# Altium project bq24259_BatteryCharger.PrjPcb
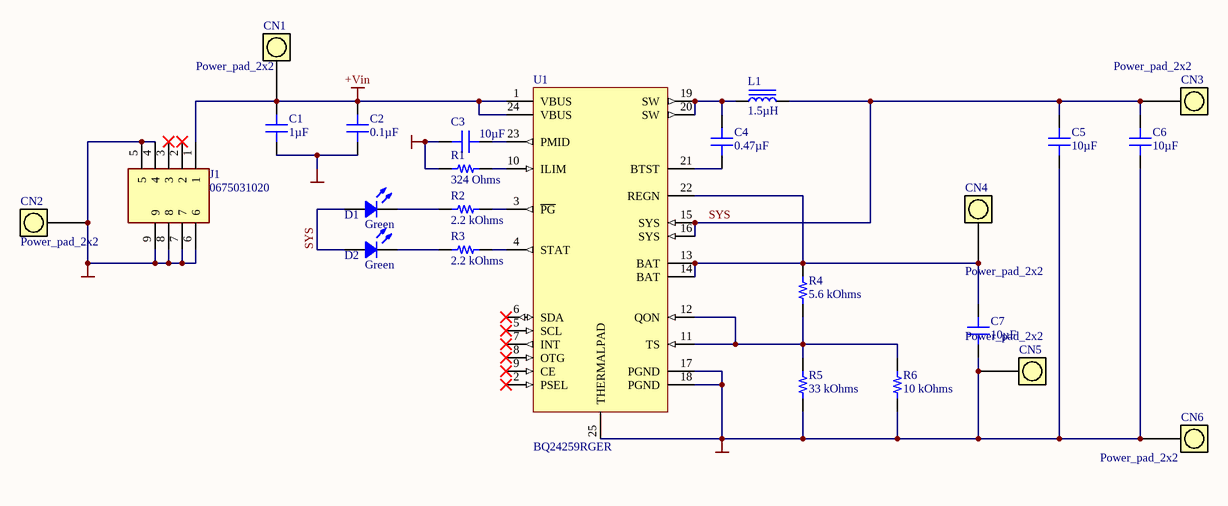
[diagram p0: bq24259_BatteryCharger.SchDoc]
1 sheet, 24 parts. Net scope: global (net labels, ports and power ports of the same name join across sheets).
Board file: bq24259_BatteryCharger.PcbDoc

## Sheet bq24259_BatteryCharger.SchDoc
size A4

### Parts
C1  1µF  [CAP 0805_2012]
C2  0.1µF  [CAP 0805_2012]
C3  10µF  [CAP 0805_2012]
C4  0.47µF  [CAP 0805_2012]
C5  10µF  [CAP 0805_2012]
C6  10µF  [CAP 0805_2012]
C7  10µF  [CAP 0805_2012]
CN1  Power_pad_2x2  [Power_pad_2x2]
CN2  Power_pad_2x2  [Power_pad_2x2]
CN3  Power_pad_2x2  [Power_pad_2x2]
CN4  Power_pad_2x2  [Power_pad_2x2]
CN5  Power_pad_2x2  [Power_pad_2x2]
CN6  Power_pad_2x2  [Power_pad_2x2]
D1  Green  [LED 0603_1608 GREEN]
D2  Green  [LED 0603_1608 GREEN]
J1  0675031020  [0675031020]
L1  1.5µH  [IND 1008_2520]
R1  324 Ohms  [RES 0805_2012]
R2  2.2 kOhms  [RES 0805_2012]
R3  2.2 kOhms  [RES 0805_2012]
R4  5.6 kOhms  [RES 0805_2012]
R5  33 kOhms  [RES 0805_2012]
R6  10 kOhms  [RES 0805_2012]
U1  BQ24259RGER  [QFN50P400X400X100-25N]

### Nets
+Vin: C1.2 C2.2 CN1.1 J1.1 U1.1(VBUS) U1.24(VBUS)
GND: C1.1 C2.1 C3.1 C5.1 C6.1 C7.1 CN2.1 CN5.1 CN6.1 J1.4 J1.5 J1.6 J1.7 J1.8 J1.9 R1.1 R5.1 R6.1 U1.17(PGND) U1.18(PGND) U1.25(THERMALPAD)
SYS: C5.2 C6.2 CN3.1 D1.1 D2.1 L1.2 U1.15(SYS) U1.16(SYS)
NetC3_2: C3.2 U1.23(PMID)
NetC4_1: C4.1 U1.21(BTST)
NetC4_2: C4.2 L1.1 U1.19(SW) U1.20(SW)
NetC7_2: C7.2 CN4.1 R4.1 U1.13(BAT) U1.14(BAT) U1.22(REGN)
NetD1_2: D1.2 R2.1
NetD2_2: D2.2 R3.1
NetR1_2: R1.2 U1.10(ILIM)
NetR2_2: R2.2 U1.3(~{PG})
NetR3_2: R3.2 U1.4(STAT)
NetR4_2: R4.2 R5.2 R6.2 U1.11(TS) U1.12(QON)

Not connected (* = marked no-connect by the designer): J1 2* 3*; U1 2(PSEL)* 5(SCL)* 6(SDA)* 7(INT)* 8(OTG)* 9(CE)*

### Library data of the parts
C1 = MM05ZC105KCZ2A: CAP CER 1UF 10V X7R 0805; Manufacturer: AVX Corporation; Tolerance: ±10%; Part Number: MM05ZC105KCZ2A; Value: 1µF; Applications: Medical, Non-Critical; Capacitance: 1µF; ComponentLink1Description: Datasheet; ComponentLink1URL: http://datasheets.avx.com/AVX-MM.pdf; ComponentLink2Description: DigiKey Link; ComponentLink2URL: http://digikey.com/product-detail/en/avx-corporation/MM05ZC105KCZ2A/478-10611-1-ND/7344872; Device Package: 0805 (2012 Metric); LastUpdated: 2.09.2020 01:04:42; Lifecycle Status: Active; Minimum Order: 1; Mounting Type: Surface Mount, MLCC; Operating Temperature: -55°C ~ 125°C; Package / Case: 0805 (2012 Metric); Packaging: TapeAndReel; PartId: 2439; Part Status: Active; Price: 0.50; Series: MM; Size / Dimension: 0.079" L x 0.049" W (2.01mm x 1.25mm); Supplier 1: DigiKey; Supplier Part Number 1: 478-10611-1-ND; Temperature Coefficient: X7R; Thickness (Max): 0.029" (0.74mm); Voltage - Rated: 10V
C2 = CC0805MRX7R9BB104: CAP CER 0.1UF 50V X7R 0805; Manufacturer: Yageo; Tolerance: ±20%; Part Number: CC0805MRX7R9BB104; Value: 0.1µF; Applications: General Purpose; Capacitance: 0.1µF; ComponentLink1Description: Datasheet; ComponentLink1URL: https://www.yageo.com/upload/media/product/productsearch/datasheet/mlcc/UPY-GPHC_X7R_6.3V-to-50V_18.pdf; ComponentLink2Description: DigiKey Link; ComponentLink2URL: http://digikey.com/product-detail/en/yageo/CC0805MRX7R9BB104/311-4351-1-ND/8025440; Device Package: 0805 (2012 Metric); LastUpdated: 2.09.2020 01:04:42; Lifecycle Status: Active; Minimum Order: 1; Mounting Type: Surface Mount, MLCC; Operating Temperature: -55°C ~ 125°C; Package / Case: 0805 (2012 Metric); Packaging: TapeAndReel; PartId: 2475; Part Status: Active; Price: 0.02; Series: CC; Size / Dimension: 0.079" L x 0.049" W (2.00mm x 1.25mm); Supplier 1: DigiKey; Supplier Part Number 1: 311-4351-1-ND; Temperature Coefficient: X7R; Thickness (Max): 0.037" (0.95mm); Voltage - Rated: 50V
C3 C5-C7 = C0805X106K9RACAUTO: CAP CER 10UF 6.3V X7R 0805; Manufacturer: KEMET; Tolerance: ±10%; Part Number: C0805X106K9RACAUTO; Value: 10µF; Applications: Automotive, Boardflex Sensitive; Capacitance: 10µF; ComponentLink1Description: Datasheet; ComponentLink1URL: https://api.kemet.com/component-edge/download/datasheet/C0805X106K9RACAUTO.pdf; ComponentLink2Description: DigiKey Link; ComponentLink2URL: http://digikey.com/product-detail/en/kemet/C0805X106K9RACAUTO/399-15698-1-ND/7427578; Device Package: 0805 (2012 Metric); Features: Soft Termination; LastUpdated: 2.09.2020 01:04:41; Lifecycle Status: Active; Minimum Order: 1; Mounting Type: Surface Mount, MLCC; Operating Temperature: -55°C ~ 125°C; Package / Case: 0805 (2012 Metric); Packaging: TapeAndReel; PartId: 2960; Part Status: Active; Price: 0.25; Ratings: AEC-Q200; Series: SMD Auto X7R Flex; Size / Dimension: 0.079" L x 0.049" W (2.00mm x 1.25mm); Supplier 1: DigiKey; Supplier Part Number 1: 399-15698-1-ND; Temperature Coefficient: X7R; Thickness (Max): 0.057" (1.45mm); Voltage - Rated: 6.3V
C4 = C0805C474K5RACAUTO: CAP CER 0.47UF 50V X7R 0805; Manufacturer: KEMET; Tolerance: ±10%; Part Number: C0805C474K5RACAUTO; Value: 0.47µF; Applications: Automotive, Bypass, Decoupling; Capacitance: 0.47µF; ComponentLink1Description: Datasheet; ComponentLink1URL: https://api.kemet.com/component-edge/download/datasheet/C0805C474K5RACAUTO.pdf; ComponentLink2Description: DigiKey Link; ComponentLink2URL: http://digikey.com/product-detail/en/kemet/C0805C474K5RACAUTO/399-6976-1-ND/3314485; Device Package: 0805 (2012 Metric); LastUpdated: 2.09.2020 01:04:41; Lifecycle Status: Active; Minimum Order: 1; Mounting Type: Surface Mount, MLCC; Operating Temperature: -55°C ~ 125°C; Package / Case: 0805 (2012 Metric); Packaging: TapeAndReel; PartId: 2727; Part Status: Active; Price: 0.08; Ratings: AEC-Q200; Series: SMD Auto X7R; Size / Dimension: 0.079" L x 0.049" W (2.00mm x 1.25mm); Supplier 1: DigiKey; Supplier Part Number 1: 399-6976-1-ND; Temperature Coefficient: X7R; Thickness (Max): 0.043" (1.10mm); Voltage - Rated: 50V
D1 D2 = LG L29K-G2J1-24-Z: LED GREEN DIFFUSED 0603 SMD; Manufacturer: OSRAM Opto Semiconductors Inc.; Configuration: Standard; Current - Test: 2mA; Lens Color: White; Lens Size: 1.30mm x 0.80mm; Lens Style: Rectangle with Flat Top; Millicandela Rating: 3.92mcd; Viewing Angle: 160°; Voltage - Forward (Vf) (Typ): 1.7V; Wavelength - Dominant: 570nm; Wavelength - Peak: 572nm; Part Number: LG L29K-G2J1-24-Z; Color: Green; ComponentLink1Description: Datasheet; ComponentLink1URL: https://dammedia.osram.info/media/resource/hires/osram-dam-2493945/LG%20L29K.pdf; ComponentLink2Description: DigiKey Link; ComponentLink2URL: http://digikey.com/product-detail/en/osram-opto-semiconductors-inc/LG-L29K-G2J1-24-Z/475-2709-1-ND/1938876; Device Package: 0603 (1608 Metric); Height (Max): 0.65mm; LastUpdated: 2.09.2020 01:20:41; Lens Transparency: Diffused; Lifecycle Status: Active; Minimum Order: 1; Mounting Type: Surface Mount; Package / Case: 0603 (1608 Metric); Packaging: TapeAndReel; PartId: 690; Part Status: Active; Price: 0.10; Series: SMARTLED® 0603; Size / Dimension: 1.70mm L x 0.80mm W; Supplier 1: DigiKey; Supplier Part Number 1: 475-2709-1-ND; Supplier Device Package: 0603; Value: Green
J1 = 0675031020: Connector; Manufacturer_Name: Molex; Datasheet Link: http://www.molex.com/webdocs/datasheets/pdf/en-us/0675031020_IO_CONNECTORS.pdf; Manufacturer_Part_Number: 0675031020; Mouser Part Number: N/A; Mouser Price/Stock: https://www.mouser.co.uk/ProductDetail/Molex/0675031020?qs=PBcRNPEHKsqIYt%2F7ECA4dQ%3D%3D; Arrow Part Number: 0675031020; Arrow Price/Stock: https://www.arrow.com/en/products/0675031020/molex
L1 = ASMPH-1008-1R5M-T: FIXED IND 1.5UH 1.5A 70 MOHM SMD; Manufacturer: Abracon LLC; Current - Saturation: 1.2A; DC Resistance (DCR): 70mOhm; Frequency - Self Resonant: 65MHz; Inductance Frequency - Test: 1MHz; Material - Core: Ferrite; Shielding: Shielded; Tolerance: ±20%; Type: Multilayer; Part Number: ASMPH-1008-1R5M-T; ComponentLink1Description: Datasheet; ComponentLink1URL: https://abracon.com/Magnetics/power/ASMPH-1008.pdf; ComponentLink2Description: DigiKey Link; ComponentLink2URL: http://digikey.com/product-detail/en/abracon-llc/ASMPH-1008-1R5M-T/535-12283-1-ND/4214883; Current Rating (Amps): 1.5A; Device Package: 1008 (2520 Metric); Height - Seated (Max): 0.039" (1.00mm); Inductance: 1.5µH; LastUpdated: 2.09.2020 01:29:19; Lifecycle Status: Active; Minimum Order: 1; Mounting Type: Surface Mount; Operating Temperature: -40°C ~ 85°C; Package / Case: 1008 (2520 Metric); Packaging: TapeAndReel; PartId: 3465; Part Status: Active; Price: 0.13; Series: ASMPH-1008; Size / Dimension: 0.098" L x 0.079" W (2.50mm x 2.00mm); Supplier 1: DigiKey; Supplier Part Number 1: 535-12283-1-ND; Supplier Device Package: 1008 (2520 Metric); Value: 1.5µH
R1 = RC0805FR-07324RL: RES SMD 324 OHM 1% 1/8W 0805; Manufacturer: Yageo; Power (Watts): 0.125W, 1/8W; Temperature Coefficient: ±100ppm/°C; Part Number: RC0805FR-07324RL; Value: 324 Ohms; ComponentLink1Description: Datasheet; ComponentLink1URL: https://www.yageo.com/upload/media/product/productsearch/datasheet/rchip/PYu-RC_Group_51_RoHS_L_10.pdf; ComponentLink2Description: DigiKey Link; ComponentLink2URL: http://digikey.com/product-detail/en/yageo/RC0805FR-07324RL/311-324CRCT-ND/730807; Composition: Thick Film; Device Package: 0805 (2012 Metric); Features: Moisture Resistant; Height - Seated (Max): 0.024" (0.60mm); LastUpdated: 2.09.2020 01:14:58; Lifecycle Status: Active; Minimum Order: 1; Number of Terminations: 2; Operating Temperature: -55°C ~ 155°C; Package / Case: 0805 (2012 Metric); Packaging: CutTape; PartId: 39528; Part Status: Active; Price: 0.10; Resistance: 324 Ohms; Series: RC; Size / Dimension: 0.079" L x 0.049" W (2.00mm x 1.25mm); Supplier 1: DigiKey; Supplier Part Number 1: 311-324CRCT-ND; Supplier Device Package: 0805; Tolerance: ±1%
R2 R3 = ERA-6APB222V: RES 2.2K OHM 0.1% 1/8W 0805; Manufacturer: Panasonic Electronic Components; Power (Watts): 0.125W, 1/8W; Temperature Coefficient: ±15ppm/°C; Part Number: ERA-6APB222V; Value: 2.2 kOhms; ComponentLink1Description: Datasheet; ComponentLink1URL: https://industrial.panasonic.com/cdbs/www-data/pdf/RDM0000/AOA0000C307.pdf; ComponentLink2Description: DigiKey Link; ComponentLink2URL: http://digikey.com/product-detail/en/panasonic-electronic-components/ERA-6APB222V/P2.2KAZCT-ND/3069474; Composition: Thin Film; Device Package: 0805 (2012 Metric); Features: Automotive AEC-Q200; Height - Seated (Max): 0.024" (0.60mm); LastUpdated: 2.09.2020 01:15:21; Lifecycle Status: Active; Minimum Order: 1; Number of Terminations: 2; Operating Temperature: -55°C ~ 155°C; Package / Case: 0805 (2012 Metric); Packaging: TapeAndReel; PartId: 29309; Part Status: Active; Price: 0.17; Ratings: AEC-Q200; Resistance: 2.2 kOhms; Series: ERA-6A; Size / Dimension: 0.079" L x 0.049" W (2.00mm x 1.25mm); Supplier 1: DigiKey; Supplier Part Number 1: P2.2KAZCT-ND; Supplier Device Package: 0805; Tolerance: ±0.1%
R4 = AT0805BRD075K6L: RES 5.6K OHM 0.1% 1/8W 0805; Manufacturer: Yageo; Power (Watts): 0.125W, 1/8W; Temperature Coefficient: ±25ppm/°C; Part Number: AT0805BRD075K6L; Value: 5.6 kOhms; ComponentLink1Description: Datasheet; ComponentLink1URL: http://www.yageo.com/NewPortal/_en/search/productDocs.jsp?YageoPartNumber=AT0805BRD075K6L; ComponentLink2Description: DigiKey Link; ComponentLink2URL: http://digikey.com/product-detail/en/yageo/AT0805BRD075K6L/YAG5126CT-ND/6643291; Composition: Thin Film; Device Package: 0805 (2012 Metric); Features: Anti-Sulfur, Automotive AEC-Q200, Moisture Resistant; Height - Seated (Max): 0.024" (0.60mm); LastUpdated: 2.09.2020 01:15:21; Lifecycle Status: Active; Minimum Order: 1; Number of Terminations: 2; Operating Temperature: -55°C ~ 155°C; Package / Case: 0805 (2012 Metric); Packaging: TapeAndReel; PartId: 29265; Part Status: Active; Price: 0.17; Ratings: AEC-Q200; Resistance: 5.6 kOhms; Series: AT; Size / Dimension: 0.079" L x 0.049" W (2.00mm x 1.25mm); Supplier 1: DigiKey; Supplier Part Number 1: YAG5126CT-ND; Supplier Device Package: 0805; Tolerance: ±0.1%
R5 = ERJ-6ENF3302V: RES SMD 33K OHM 1% 1/8W 0805; Manufacturer: Panasonic Electronic Components; Power (Watts): 0.125W, 1/8W; Temperature Coefficient: ±100ppm/°C; Part Number: ERJ-6ENF3302V; Value: 33 kOhms; ComponentLink1Description: Datasheet; ComponentLink1URL: https://industrial.panasonic.com/cdbs/www-data/pdf/RDA0000/AOA0000C304.pdf; ComponentLink2Description: DigiKey Link; ComponentLink2URL: http://digikey.com/product-detail/en/panasonic-electronic-components/ERJ-6ENF3302V/P33.0KCCT-ND/1746853; Composition: Thick Film; Device Package: 0805 (2012 Metric); Features: Automotive AEC-Q200; Height - Seated (Max): 0.028" (0.70mm); LastUpdated: 2.09.2020 01:15:19; Lifecycle Status: Active; Minimum Order: 1; Number of Terminations: 2; Operating Temperature: -55°C ~ 155°C; Package / Case: 0805 (2012 Metric); Packaging: TapeAndReel; PartId: 30111; Part Status: Active; Price: 0.01; Ratings: AEC-Q200; Resistance: 33 kOhms; Series: ERJ; Size / Dimension: 0.079" L x 0.049" W (2.00mm x 1.25mm); Supplier 1: DigiKey; Supplier Part Number 1: P33.0KCCT-ND; Supplier Device Package: 0805; Tolerance: ±1%
R6 = CRCW080510K0FKEA: RES SMD 10K OHM 1% 1/8W 0805; Manufacturer: Vishay Dale; Power (Watts): 0.125W, 1/8W; Temperature Coefficient: ±100ppm/°C; Part Number: CRCW080510K0FKEA; Value: 10 kOhms; ComponentLink1Description: Datasheet; ComponentLink1URL: http://www.vishay.com/docs/20035/dcrcwe3.pdf; ComponentLink2Description: DigiKey Link; ComponentLink2URL: http://digikey.com/product-detail/en/vishay-dale/CRCW080510K0FKEA/541-10.0KCCT-ND/1180897; Composition: Thick Film; Device Package: 0805 (2012 Metric); Features: Automotive AEC-Q200; Height - Seated (Max): 0.020" (0.50mm); LastUpdated: 2.09.2020 01:15:23; Lifecycle Status: Active; Minimum Order: 1; Number of Terminations: 2; Operating Temperature: -55°C ~ 155°C; Package / Case: 0805 (2012 Metric); Packaging: TapeAndReel; PartId: 28101; Part Status: Active; Price: 0.01; Ratings: AEC-Q200; Resistance: 10 kOhms; Series: CRCW; Size / Dimension: 0.079" L x 0.049" W (2.00mm x 1.25mm); Supplier 1: DigiKey; Supplier Part Number 1: 541-10.0KCCT-ND; Supplier Device Package: 0805; Tolerance: ±1%
U1 = BQ24259RGER: IC BATTERY CHARGER 2A LION 24QFN; Manufacturer: Texas Instruments; Battery Pack Voltage: 4.2V; Fault Protection: Over Current,Over Voltage,Over Temperature; Interface: I2C,USB; Max Supply Voltage: 6.2V; Number of Cells: 1; Case/Package: VQFN; Category: Battery Management; Lead Free: Lead Free; Manufacturer Part Number: BQ24259RGER; Max Charge Current: 2A; Max Operating Temperature: 85°C; Min Operating Temperature: -40°C; Packaging: Tape and Reel; RoHS Compliant: Yes; Supplier 1: Mouser; Supplier 2: Digi-Key; Manufacturer 2: Texas Instruments; Manufacturer Part Number 2: BQ24259RGER; RoHS: Yes; Pricing 2: 1=2,31000, 10=2,07600, 25=1,95840, 100=1,66850, 250=1,56668, 500=1,37084, 1000=1,29325 (USD); ComponentLink1URL: http://www.ti.com/lit/ds/symlink/bq24259.pdf?src-supplier=Digi-Key; ComponentLink1Description: http://www.ti.com/lit/ds/symlink/bq24259.pdf?src-supplier=Digi-Key; ComponentLink2URL: http://www.ti.com/lit/gpn/bq24259?src-supplier=Mouser; ComponentLink2Description: http://www.ti.com/lit/gpn/bq24259?src-supplier=Mouser; Supplier Part Number 1: 595-BQ24259RGER; Supplier Part Number 2: 296-43322-1-ND